# Altium project pico-fmeter-AS65-2.PrjPcb (part 3 of 3)

## Sheet USB_UART.SchDoc: Title
size 420 x 297 mm; Author: G.Kasprowicz; CompanyName: WUT ISE; DrawnBy: G.Kasprowicz; Organization: WUT ISE; Address1: PW ISE; Address2: Nowowiejska 15/19 00-665 Warsaw; Address3: gkasprow@gmail.com; Revision: 2; SheetNumber: -; SheetTotal: -; ModifiedBy: -; CheckedDate: -; Title2: Title 2; DivGrp: WUT ISE; Designer: G.Kasprowicz; ModifiedDate: -; ProjectName: Sensor Box
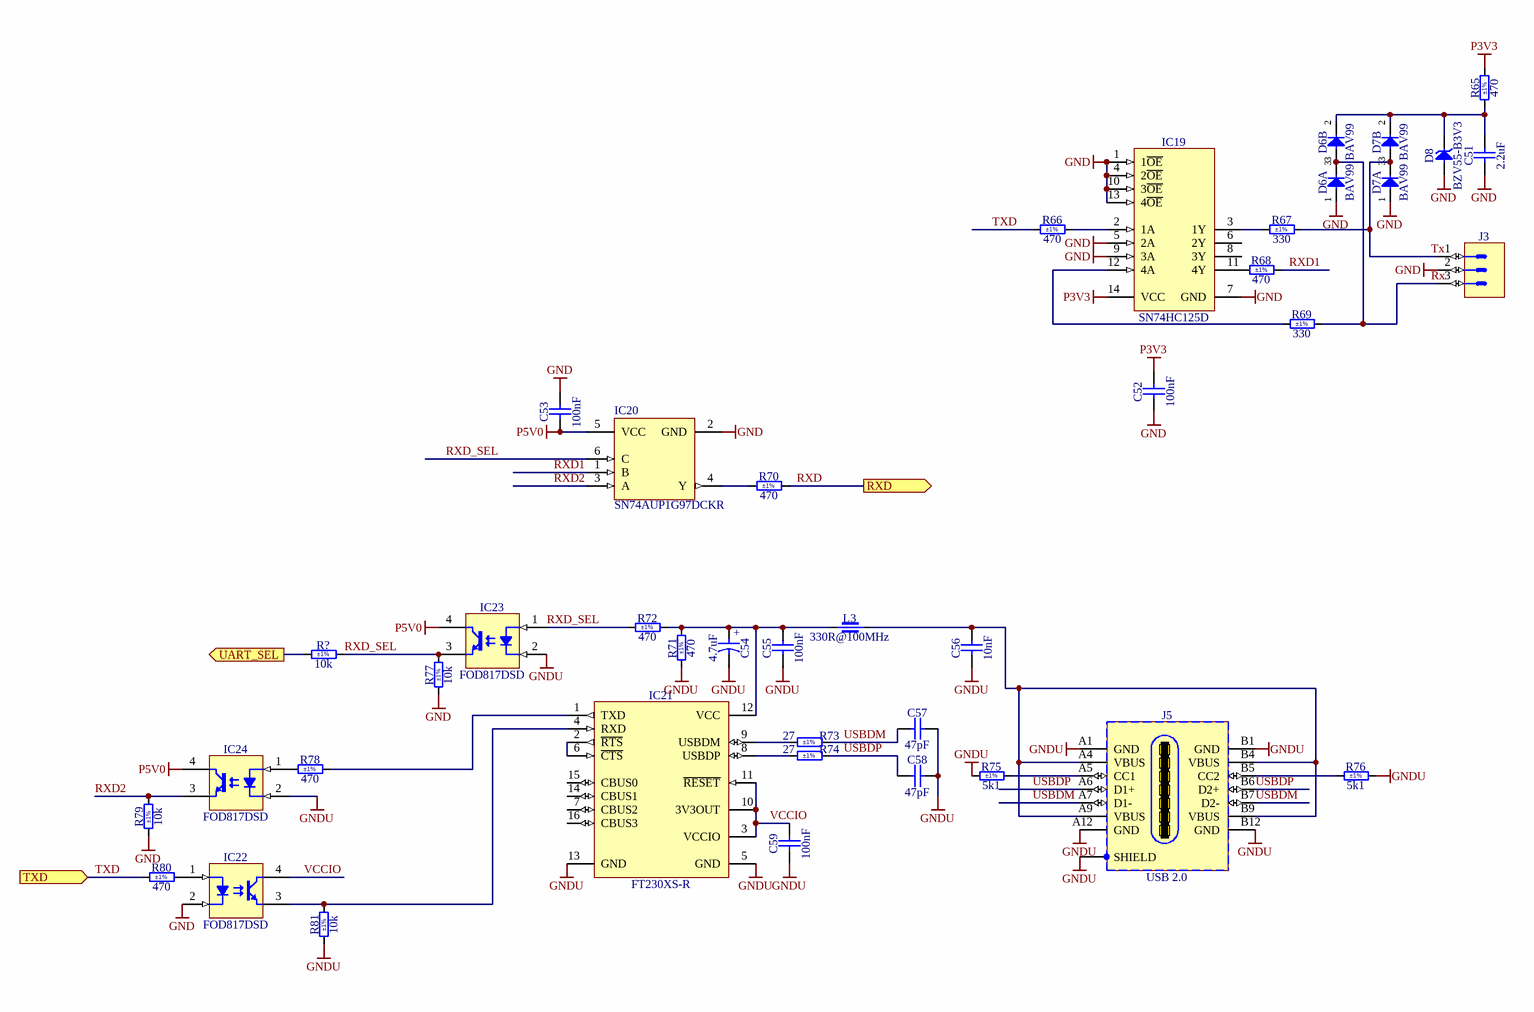
[diagram p5: USB_UART.SchDoc]

### Parts
C51  2.2uF  [CAPC1608X90N]
C52  100nF  [CAPC1608X90N]
C53  100nF  [CAPC1608X90N]
C54  4.7uF  [CAPMP3216X180N]
C55  100nF  [CAPC1608X90N]
C56  10nF  [CAPC2012X135N]
C57  47pF  [CAPC1608X87N]
C58  47pF  [CAPC1608X87N]
C59  100nF  [CAPC1608X90N]
D6  BAV99  [SOT95P240X110-3N]  (parts A,B of 2)
D7  BAV99  [SOT95P240X110-3N]  (parts A,B of 2)
D8  BZV55-B3V3  [DIOMELF3515N]
IC19  SN74HC125D  [SOIC127P600X175-14N]
IC20  SN74AUP1G97DCKR  [DCK0006A_M]
IC21  FT230XS-R  [SOP63P600X175-16N]
IC22  FOD817DSD  [FAIRCHILD_FOD817DSD]
IC23  FOD817DSD  [FAIRCHILD_FOD817DSD]
IC24  FOD817DSD  [FAIRCHILD_FOD817DSD]
J3  (no value)  [PHOENIX_1803280]
J5  USB 2.0  [KYCON_KUSBX-SL-CS1N14-B]
L3  330R@100MHz  [INDC1608X75N]
R65  470  Tolerance: ±1%  [RESC1608X55N]
R66  470  Tolerance: ±1%  [RESC1608X55N]
R67  330  Tolerance: ±1%  [RESC1608X55N]
R68  470  Tolerance: ±1%  [RESC1608X55N]
R69  330  Tolerance: ±1%  [RESC1608X55N]
R70  470  Tolerance: ±1%  [RESC1608X55N]
R71  470  Tolerance: ±1%  [RESC1608X55N]
R72  470  Tolerance: ±1%  [RESC1608X55N]
R73  27  Tolerance: ±1%  [RESC1608X55N]
R74  27  Tolerance: ±1%  [RESC1608X55N]
R75  5k1  Tolerance: ±1%  [RESC1608X55N]
R76  5k1  Tolerance: ±1%  [RESC1608X55N]
R77  10k  Tolerance: ±1%  [RESC1608X55N]
R78  470  Tolerance: ±1%  [RESC1608X55N]
R79  10k  Tolerance: ±1%  [RESC1608X55N]
R80  470  Tolerance: ±1%  [RESC1608X55N]
R81  10k  Tolerance: ±1%  [RESC1608X55N]
R?  10k  Tolerance: ±1%  [RESC1608X55N]

### Ports
RXD (out), TXD (in), UART_SEL (out)

### Nets
GND: C51.1 C52.1 C53.1 D6.1(A) D7.1(A) D8.2(A) IC19.1(1~{OE}) IC19.4(2~{OE}) IC19.5(2A) IC19.7(GND) IC19.9(3A) IC19.10(3~{OE}) IC19.13(4~{OE}) IC20.2(GND) IC22.2(C) J3.2 R77.1 R79.1
GNDU: C54.2 C55.1 C56.1 C57.2 C58.2 C59.1 IC21.5(GND) IC21.13(GND) IC23.2(C) IC24.2(C) J5.A1(GND) J5.A12(GND) J5.B1(GND) J5.B12(GND) J5.SHIELD R71.1 R75.1 R76.2 R81.1
P3V3: C52.2 IC19.14(VCC) R65.2
P5V0: C53.2 IC20.5(VCC) IC23.4(C) IC24.4(C)
Rx: D6.3(COMAC) J3.3 R69.2
RXD: R70.2 ; port RXD
RXD1: IC20.1(B) R68.2
RXD2: IC20.3(A) IC24.3(E) R79.2
RXD_SEL: IC20.6(C) IC23.1(A) IC23.3(E) R72.1 R77.2 R?.2
Tx: D7.3(COMAC) J3.1 R67.2
TXD: R66.1 R80.1 ; port TXD
USBDM: C57.1 J5.A7(D1-) J5.B7(D2-) R73.2
USBDP: C58.1 J5.A6(D1+) J5.B6(D2+) R74.2
VCCIO: C59.2 IC21.3(VCCIO) IC21.10(3V3OUT) IC21.11(~{RESET}) IC22.4(C)
NetC51_2: C51.2 D6.2(C) D7.2(C) D8.1(C) R65.1
NetC54_1: C54.1 C55.2 IC21.12(VCC) L3.1 R71.2 R72.2
NetC56_2: C56.2 J5.A4(VBUS) J5.A9(VBUS) J5.B4(VBUS) J5.B9(VBUS) L3.2
NetIC6_25: R?.1 ; port UART_SEL
NetIC19_2: IC19.2(1A) R66.2
NetIC19_3: IC19.3(1Y) R67.1
NetIC19_11: IC19.11(4Y) R68.1
NetIC19_12: IC19.12(4A) R69.1
NetIC20_4: IC20.4(Y) R70.1
NetIC21_1: IC21.1(TXD) R78.2
NetIC21_2: IC21.2(~{RTS}) IC21.6(~{CTS})
NetIC21_4: IC21.4(RXD) IC22.3(E) R81.2
NetIC21_8: IC21.8(USBDP) R74.1
NetIC21_9: IC21.9(USBDM) R73.1
NetIC22_1: IC22.1(A) R80.2
NetIC24_1: IC24.1(A) R78.1
NetJ5_A5: J5.A5(CC1) R75.2
NetJ5_B5: J5.B5(CC2) R76.1

Not connected (* = marked no-connect by the designer): IC19 6(2Y) 8(3Y); IC21 7(CBUS2) 14(CBUS1) 15(CBUS0) 16(CBUS3)

### Notes on the sheet
- Project/Equipment
- Document
- Designer
- Drawn by
- Check.by
- Copyright WUT ISE 2020.
  This documentation describes Open Hardware and is licensed under the CERN OHL v.1.2. You may redistribute and modify this documentation under the terms of the CERN OHL v.1.2. (http://ohwr.org/CERNOHL). This documentation is distributed WITHOUT ANY EXPRESS OR IMPLIED WARRANTY, INCLUDING OF MERCHANTABILITY, SATISFACTORY QUALITY AND FITNESS FOR A PARTICULAR PURPOSE. Please see the CERN OHL v.1.2 for applicable conditions.
- Contact
- File
- Last Mod.
- Print Date
- Sheet
- Size
- A3
- of
- Rev
- (in symbol CTE3216-18_4.7UF_10V_10%_LESR1400) +

### Library data of the parts
C51 = CC0603_2.2UF_10V_20%_X7R: Non-polarised capacitor; Part Description: SMD Multilayer Chip Ceramic Capacitor; Manufacturer: GENERIC; Manufacturer1 Part Number: LMK107B7225MA-T; Voltage: 10V; TC: X7R; Tolerance: ±20%; Part Number: CC0603_2.2UF_10V_20%_X7R; Component Kind: Standard; Component Type: Standard; Pin Count: 2; Value: 2.2uF; Status: Not Recommended; Manufacturer Part Number: CC0603_2.2UF_10V_20%_X7R; Case: 0603; Mounted: Yes; Socket: No; SMD: Yes; Sense: No; Manufacturer1 Example: TAIYO YUDEN; Manufacturer1 ComponentHeight: 0.9mm; HelpURL: \\cern.ch\dfs\Applications\Altium\Datasheets\CC0603_X7R_TAIYO-YUDEN_HIGH-VALUE.pdf; Author: CERN DEM JLC; CreateDate: 22.06.2011; LatestRevisionDate: 27.06.2011
C52 C53 C55 C59 = CC0603_100NF_100V_10%_X7R: Non-polarised capacitor; Part Description: SMD Multilayer Chip Ceramic Capacitor; Manufacturer: GENERIC; Manufacturer1 Part Number: GRM188R72A104KA35D; Voltage: 100V; TC: X7R; Tolerance: ±10%; Part Number: CC0603_100NF_100V_10%_X7R; Component Kind: Standard; Component Type: Standard; Pin Count: 2; Value: 100nF; Status: None; Manufacturer Part Number: CC0603_100NF_100V_10%_X7R; Case: 0603; Mounted: Yes; Socket: No; SMD: Yes; Sense: No; Manufacturer1 Example: MURATA; Manufacturer1 ComponentHeight: 0.9mm; HelpURL: \\cern.ch\dfs\Applications\Altium\Datasheets\CC0603_MURATA_GRM188R72A104KA35D.pdf; Author: CERN DEM JLC; CreateDate: 11.12.2013; LatestRevisionDate: 11.12.2013
C54 = CTE3216-18_4.7UF_10V_10%_LESR1400: Polarised capacitor; Part Description: Low ESR 1R4 Solid Tantalum Chip Capacitor; Manufacturer: GENERIC; Manufacturer1 Part Number: TPSA475K010R1400; Voltage: 10V; Tolerance: ±10%; Part Number: CTE3216-18_4.7UF_10V_10%_LESR1400; Component Kind: Standard; Component Type: Standard; Pin Count: 2; Value: 4.7uF; Status: Preferred; Manufacturer Part Number: CTE3216-18_4.7UF_10V_10%_LESR1400; Case: A; Mounted: Yes; Socket: No; SMD: Yes; Sense: No; Manufacturer1 Example: AVX; Manufacturer1 ComponentHeight: 1.8mm; HelpURL: \\cern.ch\dfs\Applications\Altium\Datasheets\CTE-LESR_AVX_TPS.pdf; Author: CERN DEM JLC; CreateDate: 05.05.2008; LatestRevisionDate: 20.01.2009
C56 = CC0805_10NF_50V_5%_C0G: Non-polarised capacitor; Part Description: SMD Multilayer Chip Ceramic Capacitor; Manufacturer: GENERIC; Manufacturer1 Part Number: C0805C103J5GACTU; Voltage: 50V; TC: C0G/NP0; Tolerance: ±5%; Part Number: CC0805_10NF_50V_5%_C0G; Component Kind: Standard; Component Type: Standard; Pin Count: 2; Value: 10nF; Status: None; Manufacturer Part Number: CC0805_10NF_50V_5%_C0G; Case: 0805; Mounted: Yes; Socket: No; SMD: Yes; Sense: No; Manufacturer1 Example: KEMET; Manufacturer1 ComponentHeight: 0.88mm; HelpURL: \\cern.ch\dfs\Applications\Altium\Datasheets\CC0805_C0G_KEMET_(Commercial Grade).pdf; Author: CERN DEM JLC; CreateDate: 02.02.2011; LatestRevisionDate: 22.04.2015
C57 C58 = CC0603_47PF_50V_5%_NP0: Non-polarised capacitor; Part Description: SMD Multilayer Chip Ceramic Capacitor; Manufacturer: GENERIC; Manufacturer1 Part Number: 223886715479; Voltage: 50V; TC: C0G/NP0; Tolerance: ±5%; Part Number: CC0603_47PF_50V_5%_NP0; Component Kind: Standard; Component Type: Standard; Pin Count: 2; Value: 47pF; Status: Preferred; Manufacturer Part Number: CC0603_47PF_50V_5%_NP0; Case: 0603; Mounted: Yes; Socket: No; SMD: Yes; Sense: No; Manufacturer1 Example: PHYCOMP; Manufacturer1 ComponentHeight: 0.87mm; HelpURL: \\cern.ch\dfs\Applications\Altium\Datasheets\CC0603_NP0_PHYCOMP.pdf; Author: CERN DEM JLC; CreateDate: 03.12.2007; LatestRevisionDate: 03.12.2007
D6 D7 = BAV99: Serial Diode; Part Description: Dual Series Signal Diode; Manufacturer: FAIRCHILD SEMICONDUCTOR; Voltage: 70V; Power: 350mW; PressFit: No; Bonding: No; Part Number: BAV99; Component Kind: Standard; Component Type: Standard; Device: BAV99; PackageDescription: SOT, 0.95mm Pitch; 3 Pin, 1.40mm W X 3.00mm L X 1.10mm H body, IPC Medium Density; Manufacturer Part Number: BAV99; Pin Count: 3; Case: SOT23-3; Mounted: Yes; Socket: No; SMD: Yes; Sense: No; ComponentHeight: 1.1mm; HelpURL: \\cern.ch\dfs\Applications\Altium\Datasheets\BAV99.pdf; Author: CERN DEM JLC; CreateDate: 06.05.2008; LatestRevisionDate: 27.09.2012
D8 = BZV55-B3V3: Zener Diode; Part Description: Voltage Regulator Diode; Manufacturer: NEXPERIA; Voltage: 3V3; Power: 500mW; PressFit: No; Bonding: No; Part Number: BZV55-B3V3; Component Kind: Standard; Component Type: Standard; Device: BZV55-B3V3; PackageDescription: SOD80C, MELF Diode, 2-Leads, Body 3.5x1.5mm, IPC Medium Density; Manufacturer Part Number: BZV55-B3V3; Pin Count: 2; Case: SOD-80C; Mounted: Yes; Socket: No; SMD: Yes; Sense: No; ComponentHeight: 1.6mm; HelpURL: \\cern.ch\dfs\Applications\Altium\Datasheets\BZV55.pdf; Author: CERN DEM JLC; CreateDate: 06.05.2008; LatestRevisionDate: 22.01.2018
IC19 = SN74HC125D: Quadruple Bus Buffer with 3-State Outputs; Manufacturer: TEXAS INSTRUMENTS; PressFit: No; Bonding: No; Part Number: SN74HC125D; Component Kind: Standard; Component Type: Standard; Device: SN74HC125D; PackageDescription: SOIC 14, Pitch 1.27mm - Body 4x8.75mm, IPC Medium Density; Part Description: Quadruple Bus Buffer with 3-State Outputs; Manufacturer Part Number: SN74HC125D; Pin Count: 14; Case: SOIC14; Mounted: Yes; Socket: No; SMD: Yes; Sense: No; ComponentHeight: 1.75mm; Author: CERN DEM JLC; HelpURL: \\cern.ch\dfs\Applications\Altium\Datasheets\SN74HC125D.pdf; CreateDate: 30.06.2011; LatestRevisionDate: 30.06.2011
IC20 = CMP-0859-00523-3: Low-Power Configurable Multiple-Function Gate, DCK0006A, LARGE T&R; Manufacturer: Texas Instruments; VCC(Min)(V): 0.8; Logic: True; Output Drive (IOL/IOH)(Max)(mA): 20/-20; 3-State Output: No; Voltage(Nom)(V): 0.8,1.2,1.5,1.8,2.5,3.3; Output Type: CMOS; Rating: Catalog; Technology Family: AUP; VCC(Max)(V): 3.6; Sub-Family: Configurable Logic; Bits(#): 1; ICC @ Nom Voltage(Max)(mA): 0.0009; tpd @ Nom Voltage(Max)(ns): 36.7,21.4,14.8,11.8,8.8,7.3; F @ Nom Voltage(Max)(Mhz): 100; DatasheetVersion: SCES505J; Gate Type: Configurable; Operating Temperature Range(C): -40 to 85; Generic Part Number: SN74AUP1G97; PackageReference: DCK0006A; Schmitt Trigger: No; Input Type: CMOS
IC21 = FT230XS-R: USB To Basic UART IC; Part Description: USB to Serial UART Interface; Manufacturer: FUTURE TECHNOLOGY DEVICES INTERNATIONAL (FTDI); PressFit: No; Bonding: No; Part Number: FT230XS-R; Component Kind: Standard; Component Type: Standard; Device: FT230XS-R; PackageDescription: SOP, 0.635mm Pitch; 16 Pin, 3.9mm W X 4.895mm L X 1.75mm H body, IPC Medium Density; Manufacturer Part Number: FT230XS-R; Pin Count: 16; Case: SSOP16; Mounted: Yes; Socket: No; SMD: Yes; Sense: No; ComponentHeight: 1.75mm; Author: CERN DEM JLC; HelpURL: \\cern.ch\dfs\Applications\Altium\Datasheets\FT230XS-R.pdf; CreateDate: 12.02.2013; LatestRevisionDate: 12.02.2013
IC22-IC24 = FOD817DSD: Single Optocoupler; Part Description: 4-Pin High Operating Temperature Phototransistor Optocoupler; Manufacturer: FAIRCHILD SEMICONDUCTOR; PressFit: No; Bonding: No; Part Number: FOD817DSD; Component Kind: Standard; Component Type: Standard; Device: FOD817DSD; PackageDescription: SOIC, 2.54mm Pitch; 4 Pin, 6.50mm W X 4.60mm L X 4.60mm H body; Manufacturer Part Number: FOD817DSD; Pin Count: 4; Case: SOIC4; Mounted: Yes; Socket: No; SMD: Yes; Sense: No; ComponentHeight: 4.6mm; HelpURL: \\cern.ch\dfs\Applications\Altium\Datasheets\FOD817DSD.pdf; Author: CERN DEM JLC; CreateDate: 21.07.2014; LatestRevisionDate: 21.07.2014
J3 = PHOENIX_1803280: Connector 3 Male; Part Description: 8A 160 V, Pitch: 3.81mm, 3 Positions  Right Angled Header; Manufacturer: PHOENIX CONTACT; Manufacturer Part Number: 1803277 (MC 1,5/ 3-G-3,81); PressFit: No; Part Number: PHOENIX_1803280; Component Kind: Standard; Component Type: Standard; Pin Count: 3; Mounted: Yes; Socket: No; SMD: No; Sense: No; Status: None; ComponentHeight: 7.25mm; HelpURL: \\cern.ch\dfs\Applications\Altium\Datasheets\PHOENIX_1803280.pdf; Author: CERN DEM BC; CreateDate: 23.09.2019; LatestRevisionDate: 23.09.2019
J5 = KYCON_KUSBX-SL-CS1N14-B: 2x7 Pin + 1 Shield  USB Type C Receptacle; Part Description: USB 2.0 Type C Receptacle, High Temp., Flag Style Through Hole 14 Pin, Black; Manufacturer: KYCON; PressFit: No; Part Number: KYCON_KUSBX-SL-CS1N14-B; Component Kind: Standard; Component Type: Standard; Pin Count: 18; Family: USB 2.0; Mounted: Yes; Socket: No; SMD: No; Sense: No; Status: None; Manufacturer Part Number: KUSBX-SL-CS1N14-B; ComponentHeight: 8.34mm; HelpURL: \\cern.ch\dfs\Applications\Altium\Datasheets\KYCON_KUSBX-SL-CS1N14-B.pdf; Author: CERN DEM BC; CreateDate: 03.11.2020; LatestRevisionDate: 03.11.2020
L3 = IND0603_TDK_MPZ1608S331ATA00: Part Description: SMT Chip Bead for Power Line; Manufacturer: TDK; Power: 1.7A; Resistance: 0.08R; Tolerance: ±25%; Part Number: IND0603_TDK_MPZ1608S331ATA00; Component Kind: Standard; Component Type: Standard; Pin Count: 2; Value: 330R@100MHz; Manufacturer Part Number: MPZ1608S331ATA00; Case: 0603; Mounted: Yes; Socket: No; SMD: Yes; Sense: No; ComponentHeight: 0.8mm; HelpURL: \\cern.ch\dfs\Applications\Altium\Datasheets\IND0603_TDK_MPZ1608.pdf; Author: CERN DEM JLC; CreateDate: 10.01.2018; LatestRevisionDate: 25.10.2018
R65 R66 R68 R70-R72 R78 R80 = R0603_470R_1%_0.1W_100PPM: Resistor - 1%; Part Description: General Purpose Thick Film Chip Resistor; Manufacturer: GENERIC; Manufacturer1 Part Number: NRC06F4700TRF; Power: 0.1W; TC: ±100ppm/°C; PressFit: No; Part Number: R0603_470R_1%_0.1W_100PPM; Component Kind: Standard; Component Type: Standard; Pin Count: 2; Value: 470; Status: Preferred; Manufacturer Part Number: R0603_470R_1%_0.1W_100PPM; Case: 0603; Mounted: Yes; Sense: No; Socket: No; SMD: Yes; Manufacturer1 Example: NIC COMPONENT; Manufacturer1 ComponentHeight: 0.55mm; HelpURL: \\cern.ch\dfs\Applications\Altium\Datasheets\R0603_NIC_NRC.pdf; Author: CERN DEM JLC; CreateDate: 03.12.2007; LatestRevisionDate: 13.03.2008
R67 R69 = R0603_330R_1%_0.1W_100PPM: Resistor - 1%; Part Description: General Purpose Thick Film Chip Resistor; Manufacturer: GENERIC; Manufacturer1 Part Number: NRC06F3300TRF; Power: 0.1W; TC: ±100ppm/°C; PressFit: No; Part Number: R0603_330R_1%_0.1W_100PPM; Component Kind: Standard; Component Type: Standard; Pin Count: 2; Value: 330; Status: Preferred; Manufacturer Part Number: R0603_330R_1%_0.1W_100PPM; Case: 0603; Mounted: Yes; Sense: No; Socket: No; SMD: Yes; Manufacturer1 Example: NIC COMPONENT; Manufacturer1 ComponentHeight: 0.55mm; HelpURL: \\cern.ch\dfs\Applications\Altium\Datasheets\R0603_NIC_NRC.pdf; Author: CERN DEM JLC; CreateDate: 03.12.2007; LatestRevisionDate: 13.03.2008
R73 R74 = R0603_27R_1%_0.1W_100PPM: Resistor - 1%; Part Description: General Purpose Thick Film Chip Resistor; Manufacturer: GENERIC; Manufacturer1 Part Number: NRC06F27R0TRF; Power: 0.1W; TC: ±100ppm/°C; PressFit: No; Part Number: R0603_27R_1%_0.1W_100PPM; Component Kind: Standard; Component Type: Standard; Pin Count: 2; Value: 27; Status: Preferred; Manufacturer Part Number: R0603_27R_1%_0.1W_100PPM; Case: 0603; Mounted: Yes; Sense: No; Socket: No; SMD: Yes; Manufacturer1 Example: NIC COMPONENT; Manufacturer1 ComponentHeight: 0.55mm; HelpURL: \\cern.ch\dfs\Applications\Altium\Datasheets\R0603_NIC_NRC.pdf; Author: CERN DEM JLC; CreateDate: 03.12.2007; LatestRevisionDate: 13.03.2008
R75 R76 = R0603_5K1_1%_0.1W_100PPM: Resistor - 1%; Part Description: General Purpose Thick Film Chip Resistor; Manufacturer: GENERIC; Manufacturer1 Part Number: NRC06F5101TRF; Power: 0.1W; TC: ±100ppm/°C; PressFit: No; Part Number: R0603_5K1_1%_0.1W_100PPM; Component Kind: Standard; Component Type: Standard; Pin Count: 2; Value: 5k1; Status: Preferred; Manufacturer Part Number: R0603_5K1_1%_0.1W_100PPM; Case: 0603; Mounted: Yes; Sense: No; Socket: No; SMD: Yes; Manufacturer1 Example: NIC COMPONENT; Manufacturer1 ComponentHeight: 0.55mm; HelpURL: \\cern.ch\dfs\Applications\Altium\Datasheets\R0603_NIC_NRC.pdf; Author: CERN DEM JLC; CreateDate: 03.12.2007; LatestRevisionDate: 13.03.2008
R77 R79 R81 R? = R0603_10K_1%_0.1W_100PPM: Resistor - 1%; Part Description: General Purpose Thick Film Chip Resistor; Manufacturer: GENERIC; Manufacturer1 Part Number: NRC06F1002TRF; Power: 0.1W; TC: ±100ppm/°C; PressFit: No; Part Number: R0603_10K_1%_0.1W_100PPM; Component Kind: Standard; Component Type: Standard; Pin Count: 2; Value: 10k; Status: Preferred; Manufacturer Part Number: R0603_10K_1%_0.1W_100PPM; Case: 0603; Mounted: Yes; Sense: No; Socket: No; SMD: Yes; Manufacturer1 Example: NIC COMPONENT; Manufacturer1 ComponentHeight: 0.55mm; HelpURL: \\cern.ch\dfs\Applications\Altium\Datasheets\R0603_NIC_NRC.pdf; Author: CERN DEM JLC; CreateDate: 03.12.2007; LatestRevisionDate: 13.03.2008

## Nets that join several sheets
GND: pico-fmeter-AS65-2 (J1.2 J2.2), Time_Base (32 pins), F_IN_CKT (15 pins), CPU_TDC (58 pins), Pico_PSU (21 pins), USB_UART (18 pins)
P3V3: Time_Base (6 pins), F_IN_CKT (8 pins), CPU_TDC (22 pins), Pico_PSU (C37.2 IC8.5 R46.2), USB_UART (C52.2 IC19.14 R65.2)
P3V3A: Time_Base (R1.2 R14.1 T4.1 T7.2), CPU_TDC (13 pins), Pico_PSU (C33.2 IC15.5 IC17.2 IC18.2)
P5V0: CPU_TDC (6 pins), Pico_PSU (7 pins), USB_UART (C53.2 IC20.5 IC23.4 IC24.4)
P5V0A: Time_Base (R47.2 T1.2), Pico_PSU (C43.2 C44.2 IC17.6 IC17.7)
PROT: Time_Base (D1.2 D3.1 R14.2 T4.2), F_IN_CKT (D4.2)
F_IN: F_IN_CKT (IC3.4), CPU_TDC (IC6.27 IC13.1 U12.1)
NetC7_1: pico-fmeter-AS65-2 (J1.1), Time_Base (C7.1 R6.1 R9.2 R10.2)
NetC11_1: pico-fmeter-AS65-2 (J2.1), F_IN_CKT (C11.1 R16.1 R17.2 R18.2)
NetIC6_25: CPU_TDC (IC6.25), USB_UART (R?.1)
REF_10MHz: Time_Base (IC10.4), CPU_TDC (IC14.29 R29.2)
REF_MUX: Time_Base (IC2.4 IC10.6 T3.1 T7.1), CPU_TDC (IC6.26)
RXD: CPU_TDC (IC6.7), USB_UART (R70.2)
TXD: CPU_TDC (IC6.6), USB_UART (R66.1 R80.1)